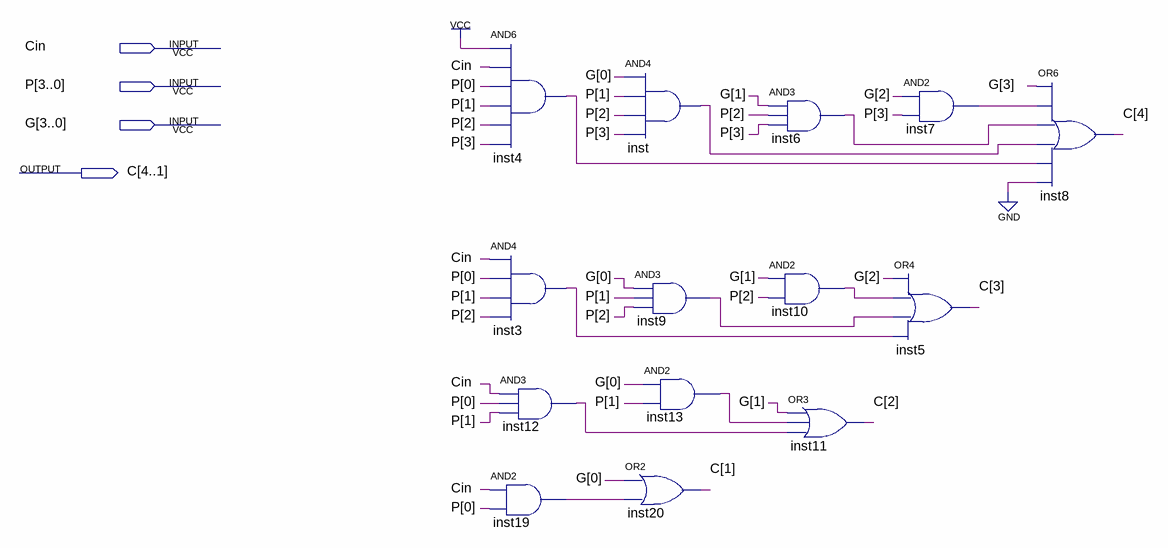
[diagram p0: schematic sheet]
// Quartus schematic CLAU4.bdf as structural Verilog: 14 symbols, 4 pins
module CLAU4 (
  input  Cin,
  input  [3:0] P,
  input  [3:0] G,
  output [4:1] C
);

  wire inst3_out, inst4_out, inst6_out, inst7_out, inst9_out, inst10_out, inst12_out, inst13_out, inst19_out,
       inst_out;

  and inst4 (inst4_out, 1'b1, Cin, P[0], P[1], P[2], P[3]);
  and inst3 (inst3_out, Cin, P[0], P[1], P[2]);
  and inst12 (inst12_out, Cin, P[0], P[1]);
  and inst19 (inst19_out, Cin, P[0]);
  and inst (inst_out, G[0], P[1], P[2], P[3]);
  and inst9 (inst9_out, G[0], P[1], P[2]);
  and inst13 (inst13_out, G[0], P[1]);
  or inst20 (C[1], G[0], inst19_out);
  and inst6 (inst6_out, G[1], P[2], P[3]);
  and inst10 (inst10_out, G[1], P[2]);
  or inst11 (C[2], G[1], inst13_out, inst12_out);
  and inst7 (inst7_out, G[2], P[3]);
  or inst5 (C[3], G[2], inst10_out, inst9_out, inst3_out);
  or inst8 (C[4], G[3], inst7_out, inst6_out, inst_out, inst4_out, 1'b0);
endmodule
